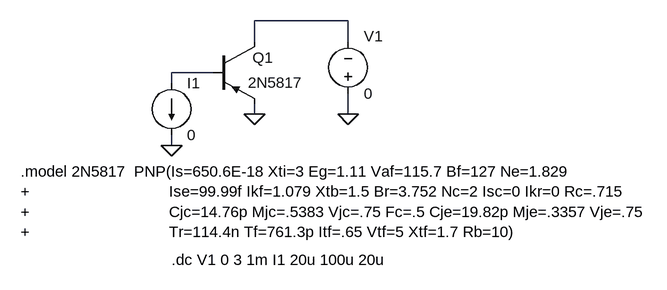
[diagram p0: schematic 2N5817.asc]
2N5817.asc, the LTspice schematic file:
Version 4
SHEET 1 1832 680
WIRE 368 -128 224 -128
WIRE 224 -96 224 -128
WIRE 368 -96 368 -128
WIRE 160 -48 96 -48
WIRE 96 -32 96 -48
WIRE 224 16 224 0
WIRE 368 16 368 -16
WIRE 96 64 96 48
FLAG 368 16 0
FLAG 224 16 0
FLAG 96 64 0
SYMBOL voltage 368 0 M180
WINDOW 0 24 104 Left 0
WINDOW 3 24 16 Left 0
SYMATTR InstName V1
SYMATTR Value 0
SYMBOL pnp 160 -96 R0
WINDOW 0 61 25 Left 0
WINDOW 3 54 63 Left 0
SYMATTR InstName Q1
SYMATTR Value 2N5817
SYMBOL current 96 -32 R0
SYMATTR InstName I1
SYMATTR Value 0
TEXT 96 240 Left 0 !.dc V1 0 3 1m I1 20u 100u 20u
TEXT -136 104 Left 0 !.model 2N5817  PNP(Is=650.6E-18 Xti=3 Eg=1.11 Vaf=115.7 Bf=127 Ne=1.829\n+                               Ise=99.99f Ikf=1.079 Xtb=1.5 Br=3.752 Nc=2 Isc=0 Ikr=0 Rc=.715\n+                               Cjc=14.76p Mjc=.5383 Vjc=.75 Fc=.5 Cje=19.82p Mje=.3357 Vje=.75\n+                               Tr=114.4n Tf=761.3p Itf=.65 Vtf=5 Xtf=1.7 Rb=10)

The netlist it stands for:
* 2N5817.asc
V1 0 N001 0
Q1 N001 N002 0 0 2N5817
I1 N002 0 0
.model NPN NPN
.model PNP PNP
.lib standard.bjt
.dc V1 0 3 1m I1 20u 100u 20u
.model 2N5817  PNP(Is=650.6E-18 Xti=3 Eg=1.11 Vaf=115.7 Bf=127 Ne=1.829
+                               Ise=99.99f Ikf=1.079 Xtb=1.5 Br=3.752 Nc=2 Isc=0 Ikr=0 Rc=.715
+                               Cjc=14.76p Mjc=.5383 Vjc=.75 Fc=.5 Cje=19.82p Mje=.3357 Vje=.75
+                               Tr=114.4n Tf=761.3p Itf=.65 Vtf=5 Xtf=1.7 Rb=10)
.backanno
.end